# EAGLE design Gateway (EAGLE 9.6.2)
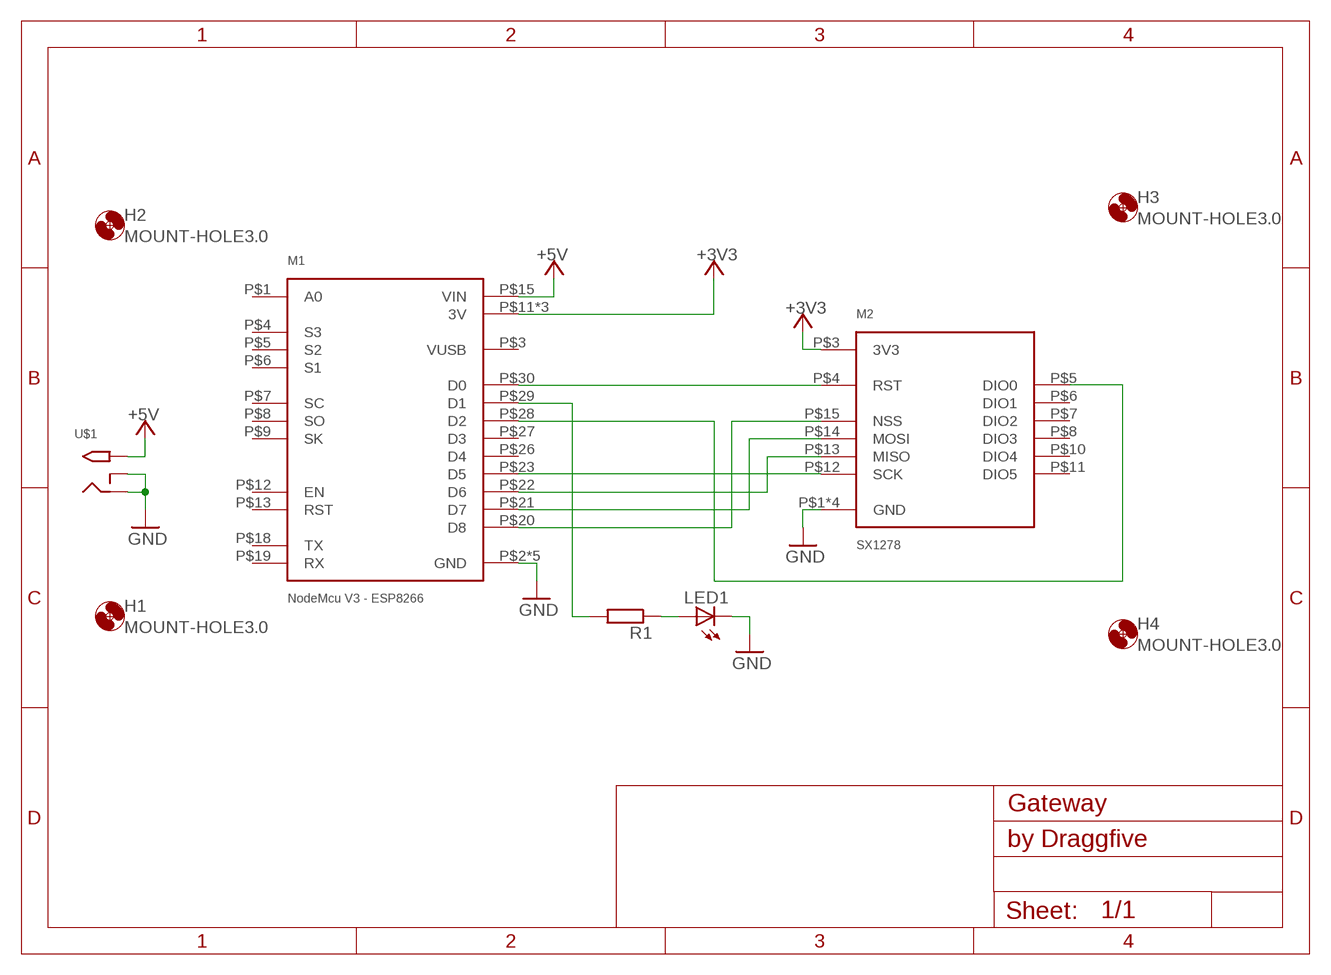
[diagram p0: schematic, sheet 1]

## Parts
H1  MOUNT-HOLE3.0  [3,0]
H2  MOUNT-HOLE3.0  [3,0]
H3  MOUNT-HOLE3.0  [3,0]
H4  MOUNT-HOLE3.0  [3,0]
LED1  LED5MM  [LED5MM]
M1  NodeMcu V3 - ESP8266  NODEMCU_V3  [NODEMCU_V3]
M2  SX1278  [SX1278]
R1  R-EU_0207/10  [0207/10]
U$1  2.1MMJACKTHM  [PJ-102A]

## Nets
+3V3: M1.P$11(3V) M1.P$16(3V) M1.P$25(3V) M2.P$3(3V3)
+5V: M1.P$15(VIN) U$1.TIP
GND: LED1.K(C) M1.P$2(GND) M1.P$10(GND) M1.P$14(GND) M1.P$17(GND) M1.P$24(GND) M2.P$1(GND) M2.P$2(GND) M2.P$9(GND) M2.P$16(GND) U$1.RING U$1.RING_SW
N$1: M1.P$29(D1) R1.2
N$2: M1.P$30(D0) M2.P$4(RST)
N$3: M1.P$28(D2) M2.P$5(DIO0)
N$4: M1.P$23(D5) M2.P$12(SCK)
N$5: M1.P$22(D6) M2.P$13(MISO)
N$6: M1.P$21(D7) M2.P$14(MOSI)
N$7: M1.P$20(D8) M2.P$15(NSS)
N$8: LED1.A R1.1
Unconnected: M1.P$1(A0) M1.P$3(VUSB) M1.P$4(S3) M1.P$5(S2) M1.P$6(S1) M1.P$7(SC) M1.P$8(SO) M1.P$9(SK) M1.P$12(EN) M1.P$13(RST) M1.P$18(TX) M1.P$19(RX) M1.P$26(D4) M1.P$27(D3) M2.P$6(DIO1) M2.P$7(DIO2) M2.P$8(DIO3) M2.P$10(DIO4) M2.P$11(DIO5)

## Notes on the sheet
- by Draggfive

## Library data of the parts
H1-H4 = holes:MOUNT-HOLE: MOUNTING HOLE with drill center marker
LED1 = adafruit:LED: LED OSRAM: - CHIPLED LG R971, LG N971, LY N971, LG Q971, LY Q971, LO R971, LY R971 LH N974, LH R974 LS Q976, LO Q976, LY Q976 LO Q996 - Hyper CHIPLED LW Q18S LB Q993, LB Q99A, LB R99A - SideLED LS A670, LO A670, LY A670, LG A670, LP A670 LB A673, LV A673, LT A673, LW A673 LH A674 LY A675 LS A676, LA A676, LO A676, LY A676, LW A676 LS A679, LY A679, LG A679 - Hyper Micro SIDELED® LS Y876, LA Y876, LO Y876, LY Y876 LT Y87S - SmartLED LW L88C, LW L88S LB L89C, LB L89S, LG L890 LS L89K, LO L89K, LY L89K LS L896, LA L896, LO L896, LY L896 - TOPLED LS T670, LO T670, LY T670, LG T670, LP T670 LSG T670, LSP T670, LSY T670, LOP T670, LYG T670 LG T671, LOG T671, LSG T671 LB T673, LV T673, LT T673, LW T673 LH T674 LS T676, LA T676, LO T676, LY T676, LB T676, LH T676, LSB T676, LW T676 LB T67C, LV T67C, LT T67C, LS T67K, LO T67K, LY T67K, LW E67C LS E67B, LA E67B, LO E67B, LY E67B, LB E67C, LV E67C, LT E67C LW T67C LS T679, LY T679, LG T679 LS T770, LO T770, LY T770, LG T770, LP T770 LB T773, LV T773, LT T773, LW T773 LH T774 LS E675, LA E675, LY E675, LS T675 LS T776, LA T776, LO T776, LY T776, LB T776 LHGB T686 LT T68C, LB T68C - Hyper Mini TOPLED® LB M676 - Mini TOPLED Santana® LG M470 LS M47K, LO M47K, LY M47K Source: http://www.osram.convergy.de/
M1 = Modules:NODEMCU_V3
M2 = Modules:SX1278
R1 = rcl:R-EU_: RESISTOR, European symbol; SPICEPREFIX: R
U$1 = adafruit:2.1MMJACK: 2.1mm x 5.5mm THM DC jack with internal switch. Digikey part #PJ-102A, 4UCON part #05537 2.1mm x 5.5mm SMT DC jack with internal switch. Digikey part #PJ-002A-SMT, 4UCON part #03267 By microbuilder.eu & adafruit.com

## Board
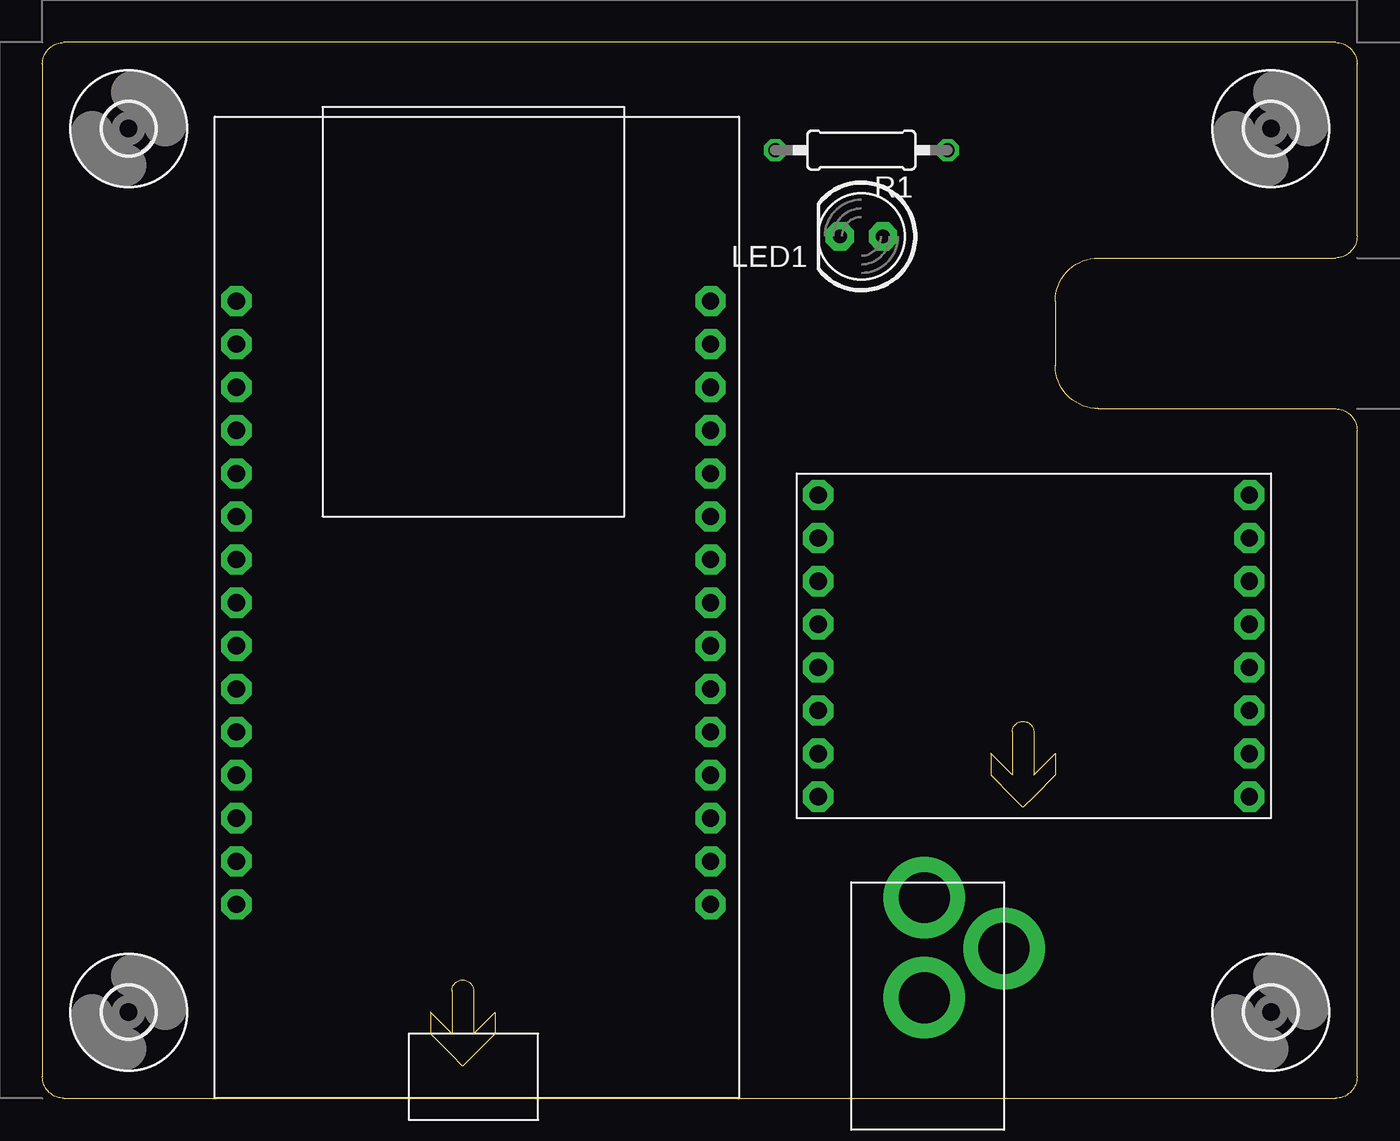
[diagram p1: board, top side]
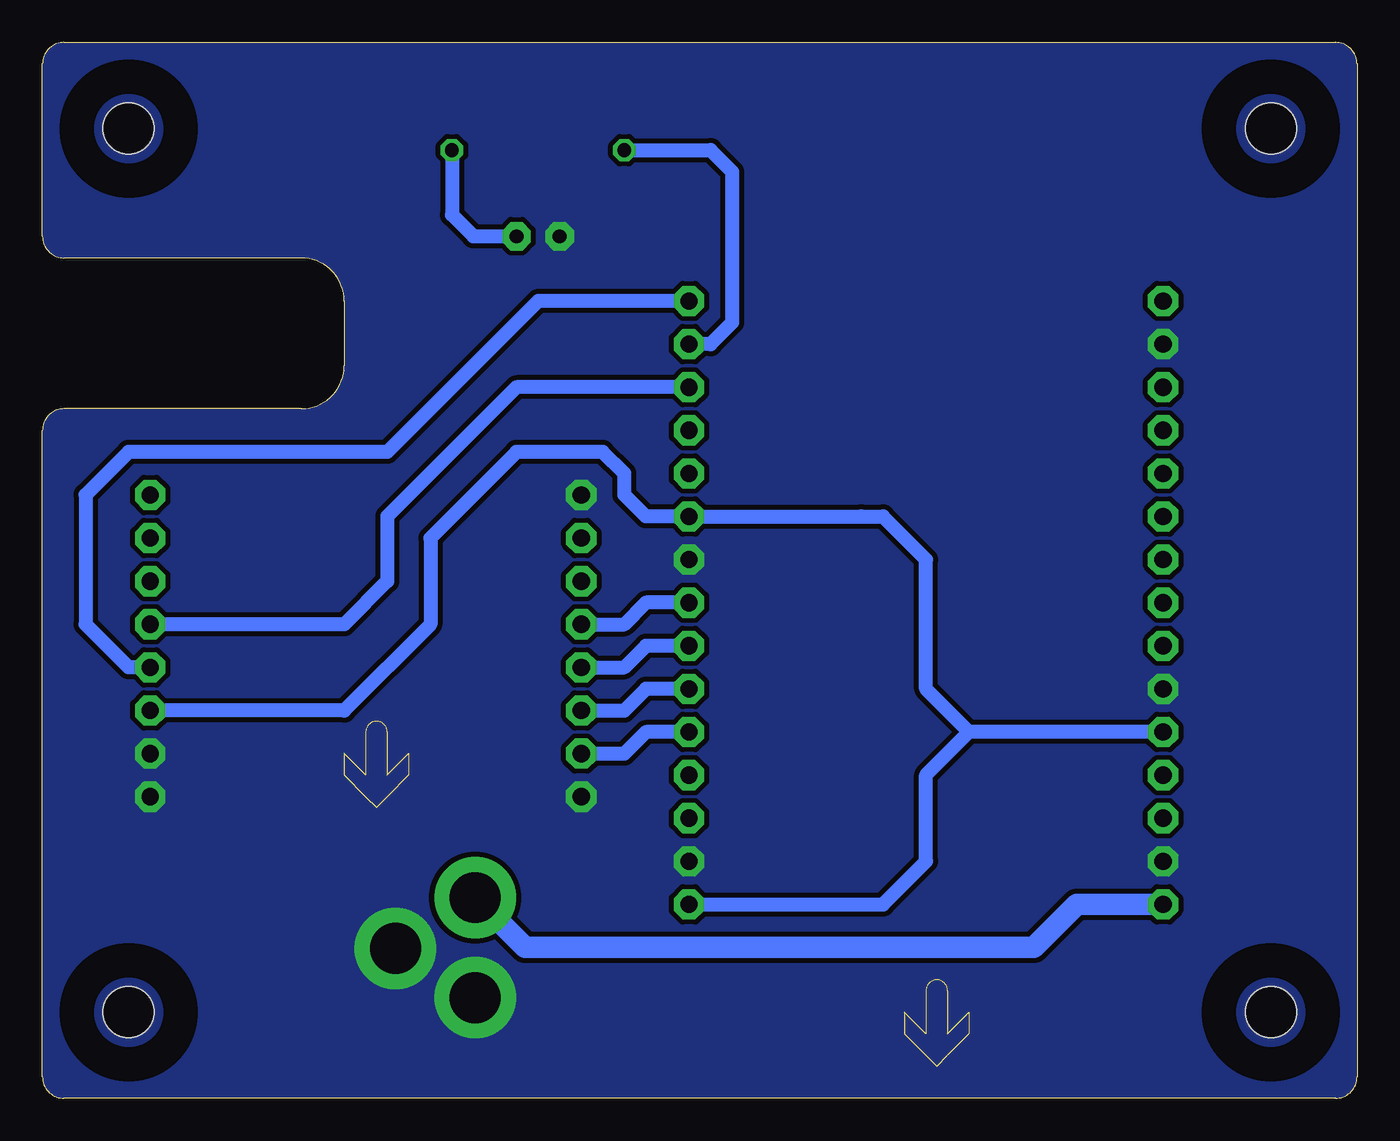
[diagram p2: board, bottom side, seen from below]

Size 77.47 x 62.23 mm. Coordinates in mm from the lower left corner, seen from the top.
Outline: 59.69,46.99 arc-90 62.23,49.53 76.2,49.53 arc90 77.47,50.8 77.47,60.96 arc90 76.2,62.23 1.27,62.23 arc90 0,60.96 0,1.27 arc90 1.27,0 76.2,0 arc90 77.47,1.27 77.47,39.37 arc90 76.2,40.64 62.23,40.64 arc-90 59.69,43.18 59.69,46.99
Outline: 24.13,6.35 24.13,3.81 22.86,5.08 22.86,3.81 24.13,2.54 24.77,1.91 25.4,2.54 26.67,3.81 26.67,5.08 25.4,3.81 25.4,6.35 arc180 24.13,6.35
Outline: 57.15,21.59 57.15,19.05 55.88,20.32 55.88,19.05 57.15,17.78 57.78,17.14 58.42,17.78 59.69,19.05 59.69,20.32 58.42,19.05 58.42,21.59 arc180 57.15,21.59
Copper layers (1*16): Top 0.035mm / dielectric 1.5mm / Bottom 0.035mm
Design rules "CNC *": minimum track width 0.3mm, minimum drill 16mil, track to track 0.3mm, track to pad 0.3mm, pad to pad 0.3mm, via to via 0.3mm, smd to smd 0.3mm, copper to edge 0mil, drill to drill 0.3mm, minimum pad ring 10mil, minimum via ring 10mil, stop-mask expansion 4mil, vias tented up to drill 0mil, thermal gap 0.3mm

### Footprints (pad centres in the part's own frame; a part is rotated, then mirrored left to right if it is on the bottom)
3,0 = hole 3: 0,0
LED5MM = drill 0.813 pad 1.676 octagon: A -1.27,0; K 1.27,0
NODEMCU_V3 = drill 1.016 pad 1.778 octagon: P$1 1.27,46.99; P$2 1.27,44.45; P$3 1.27,41.91; P$4 1.27,39.37; P$5 1.27,36.83; P$6 1.27,34.29; P$7 1.27,31.75; P$8 1.27,29.21; P$9 1.27,26.67; P$10 1.27,24.13; P$11 1.27,21.59; P$12 1.27,19.05; P$13 1.27,16.51; P$14 1.27,13.97; P$15 1.27,11.43; P$16 29.21,11.43; P$17 29.21,13.97; P$18 29.21,16.51; P$19 29.21,19.05; P$20 29.21,21.59; P$21 29.21,24.13; P$22 29.21,26.67; P$23 29.21,29.21; P$24 29.21,31.75; P$25 29.21,34.29; P$26 29.21,36.83; P$27 29.21,39.37; P$28 29.21,41.91; P$29 29.21,44.45; P$30 29.21,46.99
SX1278 = drill 1.016 pad 1.778 octagon: P$1 1.27,19.05; P$2 1.27,16.51; P$3 1.27,13.97; P$4 1.27,11.43; P$5 1.27,8.89; P$6 1.27,6.35; P$7 1.27,3.81; P$8 1.27,1.27; P$9 26.67,1.27; P$10 26.67,3.81; P$11 26.67,6.35; P$12 26.67,8.89; P$13 26.67,11.43; P$14 26.67,13.97; P$15 26.67,16.51; P$16 26.67,19.05
0207/10 = drill 0.813 octagon: 1 -5.08,0; 2 5.08,0
PJ-102A = drill 3 pad 4.8: RING 0.1,-3.39; RING_SW -4.6,-6.29; TIP 0.1,-9.29

### Placement (x,y rotation side)
H1  5.08,5.08 0 top
H2  5.08,57.15 0 top
H3  72.39,57.15 0 top
H4  72.39,5.08 0 top
LED1  48.26,50.8 180 top
M1  10.16,0 0 top
M2  72.39,36.83 180 top
R1  48.26,55.88 180 top
U$1  52.07,2.54 180 top

### Tracks (layer width: path | path; a pad name or v marks a point on that pad's centre or on a via)
+3V3
  Bottom 0.813: M2.P$3 59.69,22.86 54.61,27.94 54.61,33.02 49.53,38.1 44.45,38.1 43.18,36.83 43.18,35.56 41.91,34.29 M1.P$25 29.21,34.29 27.94,34.29 25.4,31.75 25.4,24.13 22.86,21.59 | M1.P$11 22.86,21.59 | 22.86,21.59 25.4,19.05 25.4,13.97 27.94,11.43 M1.P$16
+5V
  Bottom 1.27: M1.P$15 16.51,11.43 19.05,8.89 49.03,8.89 U$1.TIP
GND
  pour Bottom (no thermals): 1.27,0 arc-90 0,1.27 0,60.96 arc-90 1.27,62.23 76.2,62.23 arc-90 77.47,60.96 77.47,50.8 arc-90 76.2,49.53 62.23,49.53 arc90 59.69,46.99 59.69,43.18 arc90 62.23,40.64 76.2,40.64 arc-90 77.47,39.37 77.47,1.27 arc-90 76.2,0
N$1
  Bottom 0.813: M1.P$29 38.1,44.45 36.83,45.72 36.83,54.61 38.1,55.88 R1.2
N$2
  Bottom 0.813: M2.P$4 72.39,25.4 74.93,27.94 74.93,35.56 72.39,38.1 57.15,38.1 48.26,46.99 M1.P$30
N$3
  Bottom 0.813: M1.P$28 49.53,41.91 57.15,34.29 57.15,30.48 59.69,27.94 M2.P$5
N$4
  Bottom 0.813: M2.P$12 43.18,27.94 41.91,29.21 M1.P$23
N$5
  Bottom 0.813: M1.P$22 41.91,26.67 43.18,25.4 M2.P$13
N$6
  Bottom 0.813: M2.P$14 43.18,22.86 41.91,24.13 M1.P$21
N$7
  Bottom 0.813: M2.P$15 43.18,20.32 41.91,21.59 M1.P$20
N$8
  Bottom 0.813: LED1.A 52.07,50.8 53.34,52.07 R1.1